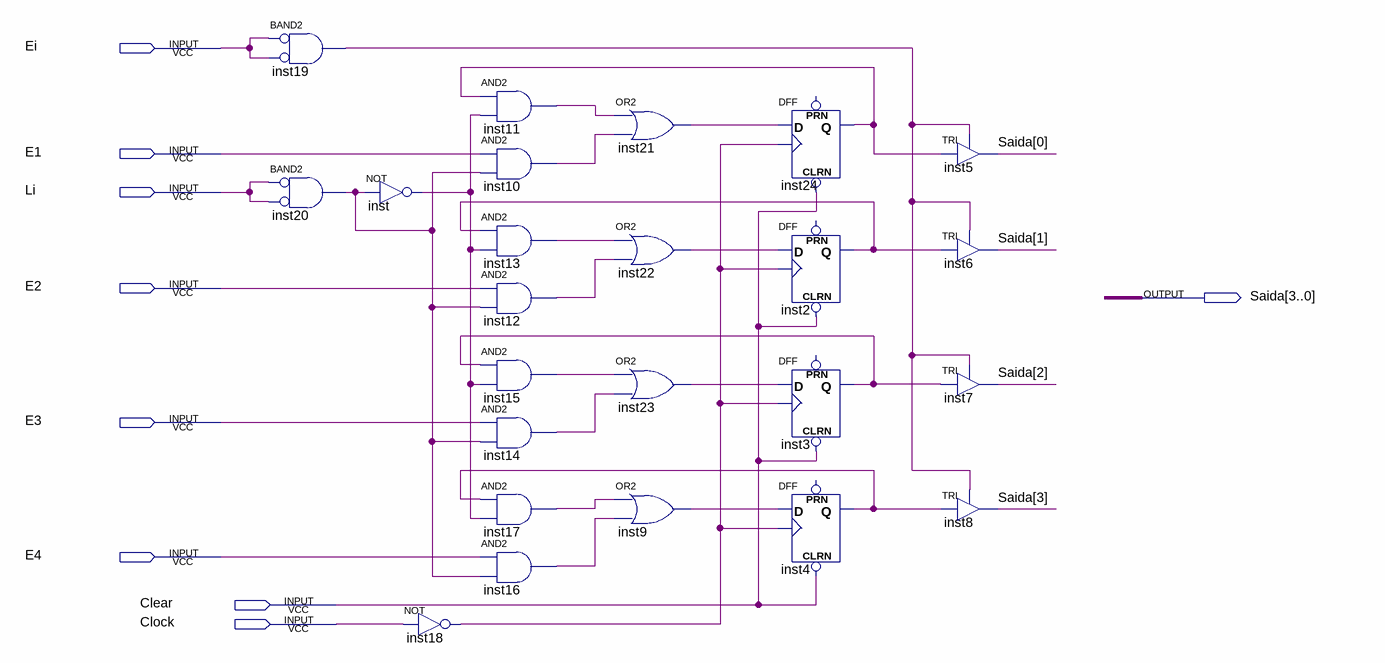
[diagram p0: schematic sheet]
// Quartus schematic Registrador_de_instrucoes.bdf as structural Verilog: 24 symbols, 9 pins
module Registrador_de_instrucoes (
  input  Ei,
  input  E1,
  input  Li,
  input  E2,
  input  E3,
  input  E4,
  input  Clear,
  input  Clock,
  output [3:0] Saida
);

  wire inst2_q, inst3_q, inst4_q, inst9_out, inst10_out, inst11_out, inst12_out, inst13_out, inst14_out,
       inst15_out, inst16_out, inst17_out, inst18_out, inst19_out, inst20_out, inst21_out, inst22_out,
       inst23_out, inst24_q, inst_out;

  and inst19 (inst19_out, ~Ei, ~Ei);  // BAND2
  and inst20 (inst20_out, ~Li, ~Li);  // BAND2
  not inst (inst_out, inst20_out);
  not inst18 (inst18_out, Clock);
  and inst11 (inst11_out, inst24_q, inst_out);
  and inst10 (inst10_out, E1, inst20_out);
  and inst13 (inst13_out, inst2_q, inst_out);
  and inst12 (inst12_out, E2, inst20_out);
  and inst15 (inst15_out, inst3_q, inst_out);
  and inst14 (inst14_out, E3, inst20_out);
  and inst17 (inst17_out, inst4_q, inst_out);
  and inst16 (inst16_out, E4, inst20_out);
  or inst21 (inst21_out, inst11_out, inst10_out);
  or inst22 (inst22_out, inst13_out, inst12_out);
  or inst23 (inst23_out, inst15_out, inst14_out);
  or inst9 (inst9_out, inst17_out, inst16_out);
  DFF inst24 (.CLRN(Clear), .CLK(inst18_out), .D(inst21_out), .Q(inst24_q));  // open: PRN
  DFF inst2 (.CLRN(Clear), .CLK(inst18_out), .D(inst22_out), .Q(inst2_q));  // open: PRN
  DFF inst3 (.CLRN(Clear), .CLK(inst18_out), .D(inst23_out), .Q(inst3_q));  // open: PRN
  DFF inst4 (.CLRN(Clear), .CLK(inst18_out), .D(inst9_out), .Q(inst4_q));  // open: PRN
  TRI inst5 (.IN(inst24_q), .OE(inst19_out), .OUT(Saida[0]));
  TRI inst6 (.IN(inst2_q), .OE(inst19_out), .OUT(Saida[1]));
  TRI inst7 (.IN(inst3_q), .OE(inst19_out), .OUT(Saida[2]));
  TRI inst8 (.IN(inst4_q), .OE(inst19_out), .OUT(Saida[3]));
endmodule
